# Altium schematic sheet E-scooter.SchDoc
size A4; Organization: Altium Limited; Address1: L3, 12a Rodborough Rd; Address2: Frenchs Forest; Address3: NSW; Address4: Australia 2086
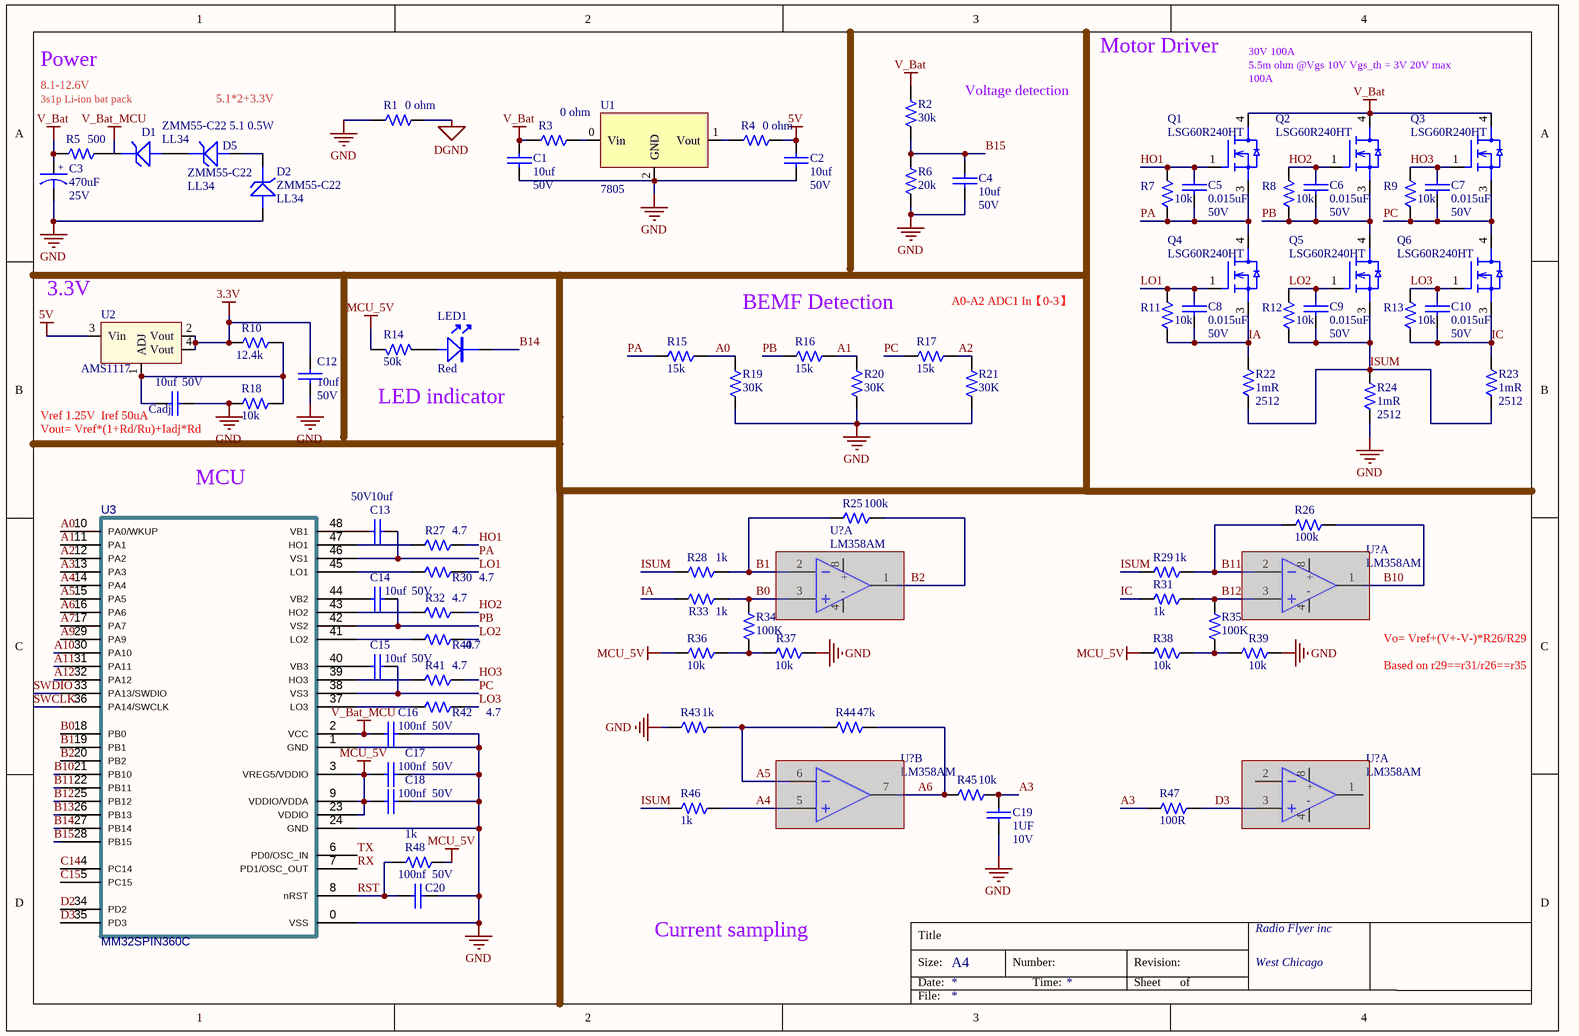
[diagram p0: E-scooter.SchDoc]

## Parts
(Parts that share a designator on the sheet are numbered #1, #2 ... from top to bottom, then left to right.)
C1  value 10uf  Voltage: 50V  [CAPC0603-RW]  (hidden comment: PXL456470-1530)
C2  value 10uf  Voltage: 50V  [CAPC0603-RW]  (hidden comment: PXL456470-1530)
C3  value 470uF  Voltage: 25V  [CASE - G]  (hidden comment: PBE099550-4710)
C4  value 10uf  Voltage: 50V  [CAPC0603-RW]  (hidden comment: PXL456470-1530)
C5  value 0.015uF  Voltage: 50V  [CAPC0603-RW]  (hidden comment: PXL456470-1530)
C6  value 0.015uF  Voltage: 50V  [CAPC0603-RW]  (hidden comment: PXL456470-1530)
C7  value 0.015uF  Voltage: 50V  [CAPC0603-RW]  (hidden comment: PXL456470-1530)
C8  value 0.015uF  Voltage: 50V  [CAPC0603-RW]  (hidden comment: PXL456470-1530)
C9  value 0.015uF  Voltage: 50V  [CAPC0603-RW]  (hidden comment: PXL456470-1530)
C10  value 0.015uF  Voltage: 50V  [CAPC0603-RW]  (hidden comment: PXL456470-1530)
C12  value 10uf  Voltage: 50V  [CAPC0603-RW]  (hidden comment: PXL456470-1530)
C13  value 10uf  Voltage: 50V  [CAPC0603-RW]  (hidden comment: PXL456470-1530)
C14  value 10uf  Voltage: 50V  [CAPC0603-RW]  (hidden comment: PXL456470-1530)
C15  value 10uf  Voltage: 50V  [CAPC0603-RW]  (hidden comment: PXL456470-1530)
C16  value 100nf  Voltage: 50V  [CAPC0603-RW]  (hidden comment: PXL456470-1530)
C17  value 100nf  Voltage: 50V  [CAPC0603-RW]  (hidden comment: PXL456470-1530)
C18  value 100nf  Voltage: 50V  [CAPC0603-RW]  (hidden comment: PXL456470-1530)
C19  value 1UF  Voltage: 10V  [CAPC0603-RW]  (hidden comment: PXL456470-1530)
C20  value 100nf  Voltage: 50V  [CAPC0603-RW]  (hidden comment: PXL456470-1530)
Cadj  value 10uf  Voltage: 50V  [CAPC0603-RW]  (hidden comment: PXL456470-1530)
D1  MFG Part: ZMM55-C22 5.1 0.5W  [LL34]  (hidden comment: RCZ005022-0010)
D2  MFG Part: ZMM55-C22  [LL34]  (hidden comment: RCZ005022-0010)
D5  MFG Part: ZMM55-C22  [LL34]  (hidden comment: RCZ005022-0010)
LED1  Color: Red  [LED1206-RED]  (hidden comment: LED1206R_23-21\R6C-AM1N2AY\2A)
Q1  MFG Part: LSG60R240HT  [TO252-3]  (hidden comment: T5860038503A6)
Q2  MFG Part: LSG60R240HT  [TO252-3]  (hidden comment: T5860038503A6)
Q3  MFG Part: LSG60R240HT  [TO252-3]  (hidden comment: T5860038503A6)
Q4  MFG Part: LSG60R240HT  [TO252-3]  (hidden comment: T5860038503A6)
Q5  MFG Part: LSG60R240HT  [TO252-3]  (hidden comment: T5860038503A6)
Q6  MFG Part: LSG60R240HT  [TO252-3]  (hidden comment: T5860038503A6)
R1  value 0 ohm  [0603-RW]  (hidden comment: T502210202399)
R2  value 30k  [0603]  (hidden comment: T5024421083A9)
R3  value 0 ohm  [0603-RW]  (hidden comment: T502210202399)
R4  value 0 ohm  [0603-RW]  (hidden comment: T502210202399)
R5  value 500  [0603-RW]  (hidden comment: T502210202399)
R6  value 20k  [0603]  (hidden comment: T5024421083A9)
R7  value 10k  [0603]  (hidden comment: T5024421083A9)
R8  value 10k  [0603]  (hidden comment: T5024421083A9)
R9  value 10k  [0603]  (hidden comment: T5024421083A9)
R10  value 12.4k  [0603]  (hidden comment: T5024421083A9)
R11  value 10k  [0603]  (hidden comment: T5024421083A9)
R12  value 10k  [0603]  (hidden comment: T5024421083A9)
R13  value 10k  [0603]  (hidden comment: T5024421083A9)
R14  value 50k  [0603]  (hidden comment: T5024421083A9)
R15  value 15k  [0603]  (hidden comment: T5024421083A9)
R16  value 15k  [0603]  (hidden comment: T5024421083A9)
R17  value 15k  [0603]  (hidden comment: T5024421083A9)
R18  value 10k  [0603]  (hidden comment: T5024421083A9)
R19  value 30K  [0603]  (hidden comment: T5024421083A9)
R20  value 30K  [0603]  (hidden comment: T5024421083A9)
R21  value 30K  [0603]  (hidden comment: T5024421083A9)
R22  value 1mR  [2512]  (hidden comment: QCF101250-1009)
R23  value 1mR  [2512]  (hidden comment: QCF101250-1009)
R24  value 1mR  [2512]  (hidden comment: QCF101250-1009)
R25  value 100k  [0603]  (hidden comment: T5024421083A9)
R26  value 100k  [0603]  (hidden comment: T5024421083A9)
R27  value 4.7  [0603]  (hidden comment: T5024421083A9)
R28  value 1k  [0603]  (hidden comment: T5024421083A9)
R29  value 1k  [0603]  (hidden comment: T5024421083A9)
R30  value 4.7  [0603]  (hidden comment: T5024421083A9)
R31  value 1k  [0603]  (hidden comment: T5024421083A9)
R32  value 4.7  [0603]  (hidden comment: T5024421083A9)
R33  value 1k  [0603]  (hidden comment: T5024421083A9)
R34  value 100K  [0603]  (hidden comment: T5024421083A9)
R35  value 100K  [0603]  (hidden comment: T5024421083A9)
R36  value 10k  [0603]  (hidden comment: T5024421083A9)
R37  value 10k  [0603]  (hidden comment: T5024421083A9)
R38  value 10k  [0603]  (hidden comment: T5024421083A9)
R39  value 10k  [0603]  (hidden comment: T5024421083A9)
R40  value 4.7  [0603]  (hidden comment: T5024421083A9)
R41  value 4.7  [0603]  (hidden comment: T5024421083A9)
R42  value 4.7  [0603]  (hidden comment: T5024421083A9)
R43  value 1k  [0603]  (hidden comment: T5024421083A9)
R44  value 47k  [0603]  (hidden comment: T5024421083A9)
R45  value 10k  [0603]  (hidden comment: T5024421083A9)
R46  value 1k  [0603]  (hidden comment: T5024421083A9)
R47  value 100R  [0603]  (hidden comment: T5024421083A9)
R48  value 1k  [0603]  (hidden comment: T5024421083A9)
U1  7805  [TO-263]
U2  AMS1117  [SOT223]
U3  MM32SPIN360C  [QFN48-6x6]
U?#1  MFG Part: LM358AM  [SO8]  (hidden comment: T610500042101)  (part A of 2)  (masked out: inside a compile mask, not in the netlist)
U?#2  MFG Part: LM358AM  [SO8]  (hidden comment: T610500042101)  (part A of 2)  (masked out: inside a compile mask, not in the netlist)
U?#3  MFG Part: LM358AM  [SO8]  (hidden comment: T610500042101)  (part B of 2)  (masked out: inside a compile mask, not in the netlist)
U?#4  MFG Part: LM358AM  [SO8]  (hidden comment: T610500042101)  (part A of 2)  (masked out: inside a compile mask, not in the netlist)

## Nets
3.3V: C12.1 R10.2 U2.2(Vout) U2.4(Vout)
5V: C2.1 R4.2 U2.3(Vin)
DGND: R1.2
GND: C1.2 C2.2 C3.2 C4.2 C12.2 C16.1 C17.1 C18.1 C19.1 C20.1 Cadj.2 D2.1(A) R1.1 R6.2 R18.2 R19.2 R20.2 R21.2 R24.1 R37.1 R39.1 R43.2 U1.2(GND) U3.0(VSS) U3.1(GND) U3.24(GND)
MCU_5V: C17.2 C18.2 R14.1 R36.2 R38.2 R48.2 U3.3(VREG5/VDDIO) U3.9(VDDIO/VDDA) U3.23(VDDIO)
V_Bat: C1.1 C3.1 Q1.4(D) Q2.4(D) Q3.4(D) R2.1 R3.1 R5.1
V_Bat_MCU: C16.2 U3.2(VCC)
A0: R15.1 R19.1 U3.10(PA0/WKUP)
A1: R16.1 R20.1 U3.11(PA1)
A2: R17.1 R21.1 U3.12(PA2)
A3: C19.2 R45.1 R47.2 U3.13(PA3)
A4: R46.1 U3.14(PA4)
A5: R43.1 R44.2 U3.15(PA5)
A6: R44.1 R45.2 U3.16(PA6)
A7: U3.17(PA7)
A9: U3.29(PA9)
A10: U3.30(PA10)
A11: U3.31(PA11)
A12: U3.32(PA12)
B0: R33.1 R34.1 U3.18(PB0)
B1: R25.2 R28.1 U3.19(PB1)
B2: R25.1 U3.20(PB2)
B10: R26.1 U3.21(PB10)
B11: R26.2 R29.1 U3.22(PB11)
B12: R31.1 R35.1 U3.25(PB12)
B13: U3.26(PB13)
B14: LED1.2(K) U3.27(PB14)
B15: C4.1 R2.2 R6.1 U3.28(PB15)
C14: U3.4(PC14)
C15: U3.5(PC15)
D2: U3.34(PD2)
D3: R47.1 U3.35(PD3)
HO1: C5.2 Q1.1(G) R7.2 R27.1
HO2: C6.2 Q2.1(G) R8.2 R32.1
HO3: C7.2 Q3.1(G) R9.2 R41.1
IA: C8.1 Q4.3(S) R11.1 R22.2 R33.2
IC: C10.1 Q6.3(S) R13.1 R23.2 R31.2
ISUM: C9.1 Q5.3(S) R12.1 R22.1 R23.1 R24.2 R28.2 R29.2 R46.2
LO1: C8.2 Q4.1(G) R11.2 R30.1
LO2: C9.2 Q5.1(G) R12.2 R40.1
LO3: C10.2 Q6.1(G) R13.2 R42.1
PA: C5.1 C13.1 Q1.3(S) Q4.4(D) R7.1 R15.2 U3.46(VS1)
PB: C6.1 C14.1 Q2.3(S) Q5.4(D) R8.1 R16.2 U3.42(VS2)
PC: C7.1 C15.1 Q3.3(S) Q6.4(D) R9.1 R17.2 U3.38(VS3)
RST: C20.2 R48.1 U3.8(nRST)
RX: U3.7(PD1/OSC_OUT)
SWCLK: U3.36(PA14/SWCLK)
SWDIO: U3.33(PA13/SWDIO)
TX: U3.6(PD0/OSC_IN)
NetC13_2: C13.2 U3.48(VB1)
NetC14_2: C14.2 U3.44(VB2)
NetC15_2: C15.2 U3.40(VB3)
NetCadj_1: Cadj.1 R10.1 R18.1 U2.1(ADJ)
NetD1_1: D1.1(A) D5.2(K)
NetD1_2: D1.2(K) R5.2
NetD2_2: D2.2(K) D5.1(A)
NetLED1_1: LED1.1(A) R14.2
NetR3_2: R3.2 U1.0(Vin)
NetR4_1: R4.1 U1.1(Vout)
NetR27_2: R27.2 U3.47(HO1)
NetR30_2: R30.2 U3.45(LO1)
NetR32_2: R32.2 U3.43(HO2)
NetR34_2: R34.2 R36.1 R37.2
NetR35_2: R35.2 R38.1 R39.2
NetR40_2: R40.2 U3.41(LO2)
NetR41_2: R41.2 U3.39(HO3)
NetR42_2: R42.2 U3.37(LO3)

## Notes on the sheet
- Power
- 3s1p Li-ion bat pack
- 8.1-12.6V
- 5.1*2+3.3V
- Voltage detection
- Motor Driver
- 30V 100A
- 5.5m ohm @Vgs 10V Vgs_th = 3V 20V max
- (near Q1) 100A
- (near U2) 3.3V
- BEMF Detection
- A0-A2 ADC1 In【0-3】
- (near Cadj) Vref 1.25V  Iref 50uA
- (near Cadj) Vout= Vref*(1+Rd/Ru)+Iadj*Rd
- LED indicator
- (near U3) MCU
- Vo= Vref+(V+-V-)*R26/R29
- Based on r29==r31/r26==r35
- Current sampling
- Title
- Size:
- Date:
- A4
- Number:
- Time:
- Revision:
- Sheet
- of
- Radio Flyer inc
- West Chicago
- File:
- (in symbol CAP E 470uF 25V 20% SMD) +
- (in symbol LM358BAIDR, part A) +; -

## Library data of the parts
C1 C2 C4-C10 C12-C20 = CAP0603 0.015uF 50V 10%: GP CHIP CAP 0.015uF 50V 10% 0603 TYPE X7R; SAP: T542021537508; Vendor Code: 10010262; Vendor Name: 东莞市晴远电子有限公司; Type: Capacitor; DIP&SMD: SMD; PACKAGE: CAPC0603; MFG: *; MFG Part: *; Other: X7R; Tolerance: 10%; Customer Specific: N/A
C3 = CAP E 470uF 25V 20% SMD: CHIP ELECT 470uF 25V 20% D10xL10 105; SAP: T551471445000; Vendor Name: 东莞市晴远电子有限公司; Vendor Code: 10010262; Type: Capacitor; DIP&SMD: SMD; PACKAGE: CASE - G; MFG: *; MFG Part: *; Other: *; Tolerance: 20%; Customer Specific: N/A
Cadj = CAP0603 0.015uF 50V 10%: GP CHIP CAP 0.015uF 50V 10% 0603 TYPE X7R; SAP: T542021537508; Vendor Code: 10010262; Vendor Name: 东莞市晴远电子有限公司; DIP&SMD: SMD; PACKAGE: CAPC0603; MFG: *; MFG Part: *; Other: X7R; Tolerance: 10%; Type: Capacitor; Customer Specific: N/A
D1 D2 D5 = ZMM55-C22-10020343: CHIP ZENER 22V 5% 0.5W MLL34; SAP: T573003862018; Vendor Name: 深圳市春明电子有限公司; Current: 5MA; Power: 500MW; DIP&SMD: SMD; Vendor Code: 10020343; MFG: *; Tolerance: 5%; VOLTAGE: 22V; Type: ZENER; Customer Specific: N/A; Package: LL34
LED1 = LED1206R_23-21\R6C-AM1N2AY\2A: CHIP LED RED TYPE 1206; MFG: EVERLIGHT; DIP&SMD: SMD; CREATE_NAME: Nathan; MFG Part: 23-21\R6C-AM1N2AY\2A; SAP: *; Package: 1206; Type: LED; CREATE_TIME: 18-Aug-2020
Q1-Q6 = NMOS LSG60R240HT: NMOS 600V LSG60R240HT TO252( LONTEN K; Current: 17A; Type: N-CHANNEL MOSFET; CREATE_NAME: Nathan; DIP&SMD: SMD; SAP: T5860038503A6; Pd: *; Vendor Code: *; Vendor Name: *; Voltage: 600V; MFG: LONTEN; CREATE_TIME: 12-Oct-2019; Rds: *; Customer Specific: N/A; Package: TO252
R1 R3-R5 = RES0603 1/16W 1% 21K OMH_WALSIN: CHIP 21K OHM 100PPM +-1% 0603 WALS L; TOL: 1%; MFG: WALSIN (華新); Power: 1/10W; CREATE_NAME: Nathan; DIP&SMD: SMD; SAP: T502210202399; Package: 0603; MFG Part: *; Vendor Code: *; Vendor Name: *; Type: Resistor; CREATE_TIME: 08-Feb-2018; Customer Specific: N/A
R2 R6-R21 R25-R48 = RES0201 1/20W 1% 4.42K OHM_WALSIN: CHIP 4.42K OHM 200PPM +-1% 0201 WALS L; MFG Part: WR02X4421FAL; Power: 1/20W; MFG: WALSIN (華新); TOL: 1%; CREATE_NAME: Nathan; DIP&SMD: SMD; Vendor Code: *; SAP: T5024421083A9; Vendor Name: *; Type: Resistor; PACKAGE: 0603; CREATE_TIME: 23-July-2019; Customer Specific: N/A
R22-R24 = RES2512 1W 1% 10 OHM: CHIP RES. 10 OHM 1W 1% 2512; Vendor Code: 10010262; SAP: T502100A07399; Vendor Name: 东莞市晴远电子有限公司; DIP&SMD: SMD; Power: 1W; MFG Part: *; MFG: *; TOL: 1%; Type: Resistor; Customer Specific: N/A; PACKAGE: 2512
U2 = AMS1117: 800mA LOW DROPOUT VOLTAGE REGULATOR , SOT-223; MFG: Advanced Monolithic Systems; CREATE_NAME: Nathan; DIP&SMD: SMD; SAP: *; Vendor Code: *; Vendor Name: *; Type: IC; CREATE_TIME: 17-Nov-2020; Package: SOT-223; Customer Specific: N/A; MFG Part: AMS1117
U?#1-U?#4 = LM358BAIDR: OP LM358BAIDR SOIC(8) TI K; CREATE_NAME: Tom; DIP&SMD: SMD; SAP: T610500042101; CREATE_TIME: 04-Jan-2020; MFG: TI; Type: IC; Customer Specific: N/A
U3 = MM32SPIN360C: Published: 30-May-2008; DatasheetVersion: rev6, Mar-2008; PackageVersion: Mar-2008; PackageReference: LQFP48; Publisher: Altium Limited; PackageDescription: 48-Pin Low-Profile Quad Flat Pack, 7 x 7 mm Body, 0.5 mm Pitch (LQFP48); ComponentLink1Description: Manufacturer Link; ComponentLink1URL: www.st.com/stm32; ComponentLink2Description: Datasheet; ComponentLink2URL: http://www.st.com/stonline/products/literature/ds/13587.pdf